# Altium schematic sheet Ultrasonic.SchDoc: Ultrasonic Sensor
size A4; ApprovedBy: zac1; Author: mmb1; DrawnBy: mmb1; Engineer: mmb1; Organization: Berne University of Applied Sciences; Address1: School of Engineering and; Address2: Information Technology; Address3: Quellgasse 21; Address4: CH-2501 Biel; Revision: 1.0; SheetNumber: 6; SheetTotal: 6
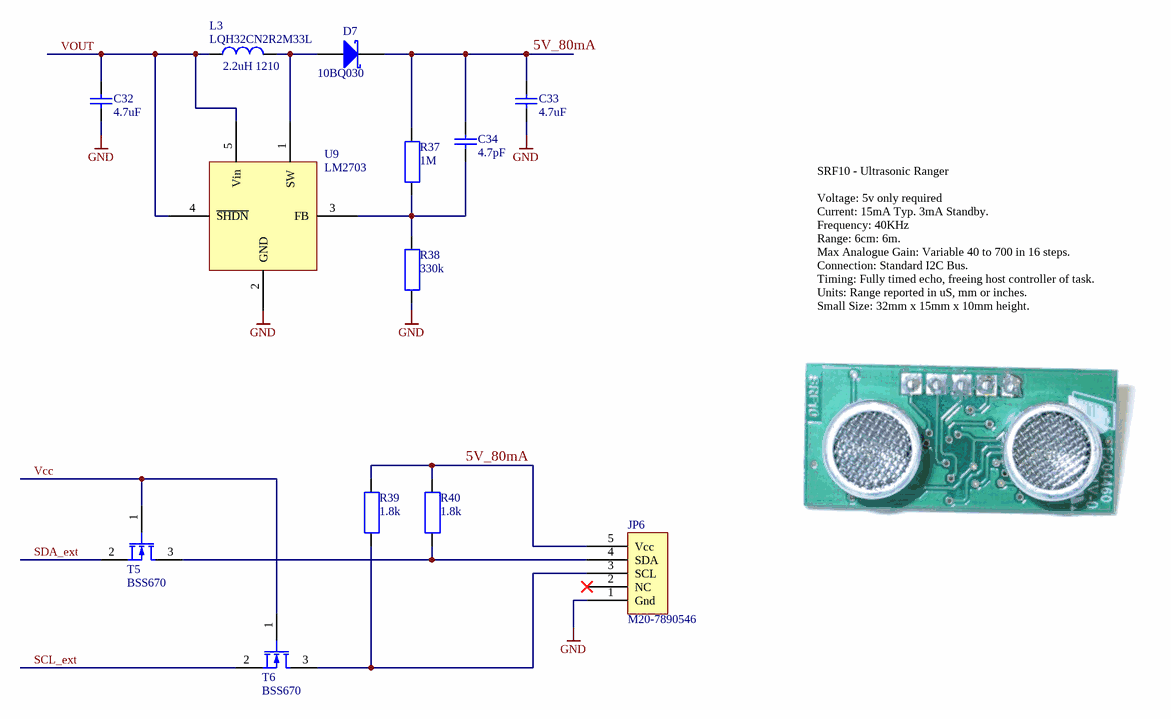
[diagram p0: Ultrasonic.SchDoc]

## Parts
C32  4.7uF  [C0805]
C33  4.7uF  [C0805]
C34  4.7pF  [C0805]
D7  10BQ030  [MBRS1100T3-D]
JP6  M20-7890546  [M20-7890546]
L3  value 2.2uH 1210  [CAPC1210L]  (hidden comment: LQH32CN2R2M33L)
R37  1M  [1608[0603]]
R38  330k  [1608[0603]]
R39  1.8k  [1608[0603]]
R40  1.8k  [1608[0603]]
T5  BSS670  [SOT-23]
T6  BSS670  [SOT-23]
U9  LM2703  [LM2703]

## Nets
GND: C32.1 C33.1 JP6.1(Gnd) R38.1(J1) U9.2(GND)
5V_80mA: C33.2 C34.2 D7.2(K) JP6.5(Vcc) R37.2(J2) R39.2(J2) R40.2(J2)
SCL_ext: T6.2(S)
SDA_ext: T5.2(S)
Vcc: T5.1(G) T6.1(G)
VOUT: C32.2 L3.1(J1) U9.4(~{SHDN}) U9.5(Vin)
NetC34_1: C34.1 R37.1(J1) R38.2(J2) U9.3(FB)
NetD7_1: D7.1(A) L3.2(J2) U9.1(SW)
NetJP6_3: JP6.3(SCL) R39.1(J1) T6.3(D)
NetJP6_4: JP6.4(SDA) R40.1(J1) T5.3(D)

Not connected (* = marked no-connect by the designer): JP6 2(NC)*

## Notes on the sheet
- SRF10 - Ultrasonic Ranger
  Voltage: 5v only required
  Current: 15mA Typ. 3mA Standby.
  Frequency: 40KHz
  Range: 6cm: 6m.
  Max Analogue Gain: Variable 40 to 700 in 16 steps.
  Connection: Standard I2C Bus.
  Timing: Fully timed echo, freeing host controller of task.
  Units: Range reported in uS, mm or inches.
  Small Size: 32mm x 15mm x 10mm height.
- Title:
- Size:
- Date:
- A4_L
- Author:
- Time:
- Revision:
- Sheet
- of
- File:

## Library data of the parts
C32 C33 = Cap: Capacitor; Manufacturer: Kemet; Part Number: C0805C475K4PAC; Currency: CHF; Packaging unit: 10; Published: 8-Jun-2000; LatestRevisionDate: 17-Jul-2002; LatestRevisionNote: Re-released for DXP Platform.; Publisher: Altium Limited; Value: 4.7uF; Distributor: Farnell; Distributor Number: 9227 849; Price: 0.508; RoHS: yes
C34 = Cap: Capacitor; Manufacturer: AVX; Part Number: 06032U4R7CAT2A; Value: 4.7pF 0603; Currency: CHF; Packaging unit: 5; Published: 8-Jun-2000; LatestRevisionDate: 17-Jul-2002; LatestRevisionNote: Re-released for DXP Platform.; Publisher: Altium Limited; Distributor: Farnell; Distributor Number: 7568 258; Price: 0.45; RoHS: yes
D7 = D Schottky: Schottky Diode; Manufacturer: Vishay; Part Number: 10BQ030PBF; Currency: CHF; Packaging unit: 1; Value: 10BQ030; Distributor: Farnell; Distributor Number: 9100 687; Price: 0.42; RoHS: yes
JP6 = M20-7890546: Manufacturer: HARWIN; Currency: CHF; Packaging unit: 10; Value: M20-7890546; Distributor: Farnell; Distributor Number: 7992 076; Part Number: M20-7890546; RoHS: yes; Price: 1.45
L3 = COIL-LQH: Inductance; Manufacturer: Murata; Currency: CHF; Packaging unit: 5; Part Type: LQH32CN2R2M33L; Distributor: Farnell; Distributor Number: 9522 182; Part Number: LQH32CN2R2M33L; RoHS: yes; Price: 0.357
R37 = RES: Resistance; Manufacturer: Multicomp; Part Number: MC 0.063W 0603 1% 1M; Value: 1M 0603; Currency: CHF; Packaging unit: 50; Part Type: 1M; Distributor: Farnell; Distributor Number: 9330 410; RoHS: X-yes; Price: 0.062
R38 = RES: Resistance; Manufacturer: Multicomp; Part Number: MC 0.063W 0603 1% 330K; Value: 330k 0603; Currency: CHF; Packaging unit: 50; Part Type: 330k; Distributor: Farnell; Distributor Number: 9331 042; RoHS: X-yes; Price: 0.062
R39 R40 = RES: Resistance; Manufacturer: Multicomp; Part Number: MC 0.063W 0603 1% 1K8; Value: 1.8k 0603; Currency: CHF; Packaging unit: 50; Part Type: 1.8k; Distributor: Farnell; Distributor Number: 9330 712; RoHS: X-yes; Price: 0.062
T5 T6 = MOSFET-N: Manufacturer: Infineon; Part Number: BSS670S2L; Currency: CHF; Packaging unit: 5; Value: BSS670; Distributor: Farnell; Distributor Number: 1095 673; Price: 0.35; RoHS: yes
U9 = LM2703: Manufacturer: National; Part Number: LM2703MF-ADJ; Currency: CHF; Packaging unit: 1; Part Type: LM2703; Value: LM2703; Distributor: Farnell; Distributor Number: 9779 442; RoHS: yes; Price: 4